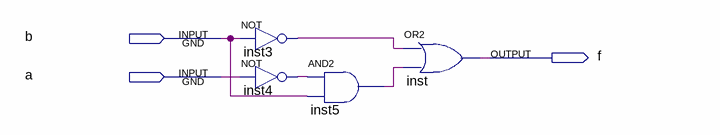
[diagram p0: schematic sheet]
// Quartus schematic 2-2-1-before.bdf as structural Verilog: 4 symbols, 3 pins
module \2-2-1-before  (
  input  b,
  input  a,
  output f
);

  wire inst3_out, inst4_out, inst5_out;

  not inst3 (inst3_out, b);
  not inst4 (inst4_out, a);
  and inst5 (inst5_out, inst4_out, b);
  or inst (f, inst3_out, inst5_out);
endmodule
